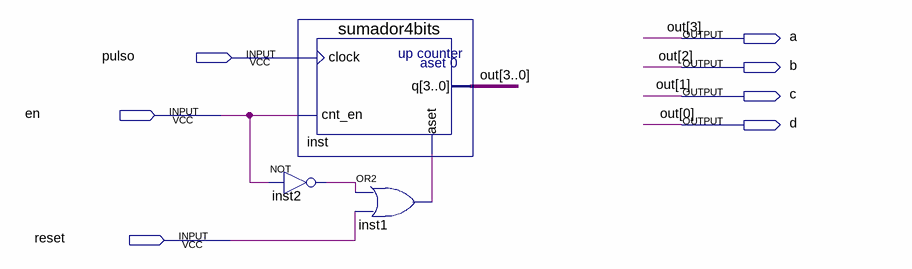
[diagram p0: schematic sheet]
// Quartus schematic sumadorBasico.bdf as structural Verilog: 3 symbols, 7 pins
module sumadorBasico (
  input  pulso,
  input  en,
  input  reset,
  output a,
  output b,
  output c,
  output d
);

  wire inst1_out, inst2_out;

  sumador4bits inst (.clock(pulso), .cnt_en(en), .aset(inst1_out), .q({a, b, c, d}));
  not inst2 (inst2_out, en);
  or inst1 (inst1_out, inst2_out, reset);

  // Other names for the same wires on the sheet: out[3:0] = {a, b, c, d}
endmodule
